# EAGLE schematic Schematic_v22 (EAGLE 9.6.2)
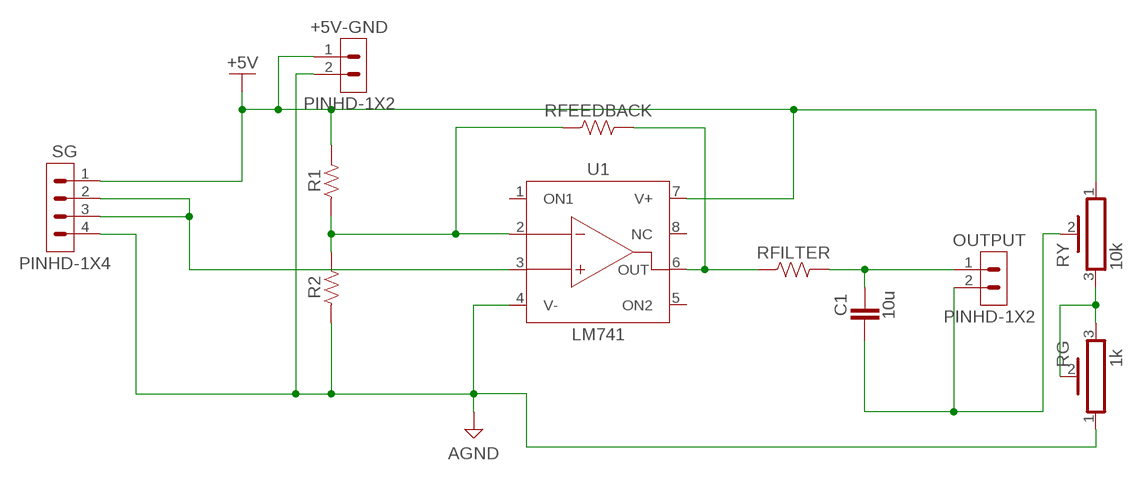
[diagram p0: schematic, sheet 1]

## Parts
+5V-GND  PINHD-1X2  [1X02]
C1  10u  CAPACITORCERAMIC-2.54MM  [CAP-THRU-2.54MM]
OUTPUT  PINHD-1X2  [1X02]
R1  1k  R-US_AXIAL-7.2MM-PITCH  [RESAD724W46L381D178B]
R2  1k  R-US_AXIAL-7.2MM-PITCH  [RESAD724W46L381D178B]
RFEEDBACK  24M  R-US_AXIAL-7.2MM-PITCH  [RESAD724W46L381D178B]
RFILTER  47k  R-US_AXIAL-7.2MM-PITCH  [RESAD724W46L381D178B]
RG  1k  POT_HA-06  [HA-06-SM065]
RY  10k  POT_HA-06  [HA-06-SM065]
SG  PINHD-1X4  [1X04]
U1  LM741  [DIP826W53P254L959H508Q8B]

## Nets
+5V: +5V-GND.1 R1.2 RY.1 SG.1 U1.7(V+)
AGND: +5V-GND.2 R2.1 RG.1 SG.4 U1.4(V-)
N$1: C1.1 OUTPUT.1 RFILTER.2
N$2: RG.2 RG.3 RY.3
N$3: RFEEDBACK.2 RFILTER.1 U1.6(OUT)
N$4: R1.1 R2.2 RFEEDBACK.1 U1.2(-IN)
N$5: SG.2 SG.3 U1.3(+IN)
N$6: C1.2 OUTPUT.2 RY.2
Unconnected: U1.1(ON1) U1.5(ON2) U1.8(NC)

## Library data of the parts
+5V-GND OUTPUT = Connector:PINHD-1X2: Pin Header; CATEGORY: Connectors; DESCRIPTION: Header-Straight-2 Position; PACKAGE_TYPE: Through Hole; PITCH: 0.100" (2.54mm); SUBCATEGORY: Headers; TYPE: Male Pins
C1 = Tinkercad:CAPACITOR: Capacitor - Generic
R1 R2 RFEEDBACK RFILTER = Resistor:R-US: Resistor Fixed - ANSI; CATEGORY: Resistors; DESCRIPTION: Axial Resistor 7.24 mm pitch 3.81 mm body length 1.78 mm body diameter; PACKAGE_SIZE: Axial; PACKAGE_TYPE: Through Hole
RG RY = Tinkercad:POT: Rectangular Trimmer Potentiometers - PV36 Series Datasheet <https://www.bourns.com/docs/Product-Datasheets/pv36.pdf>
SG = Connector:PINHD-1X4: Pin Header; CATEGORY: Connectors; DESCRIPTION: Header-Straight-4 Position; PACKAGE_TYPE: Through Hole; PITCH: 0.100" (2.54mm); SUBCATEGORY: Headers; TYPE: Male Pins
U1 = IC_Linear:LM741: Operational Amplifier Reference: Datasheet <https://www.ti.com/lit/ds/symlink/lm741.pdf>; CATEGORY: Linear ICs; DESCRIPTION: General Purpose Amplifier 1 Circuit 8-PDIP; PACKAGE_SIZE: 8-PDIP; PACKAGE_TYPE: Through Hole; ROHS: Compliant; SERIES: LM741; SUBCATEGORY: Amplifiers; TYPE: General Purpose